# Altium project POWER_DC_5V.PrjPcb
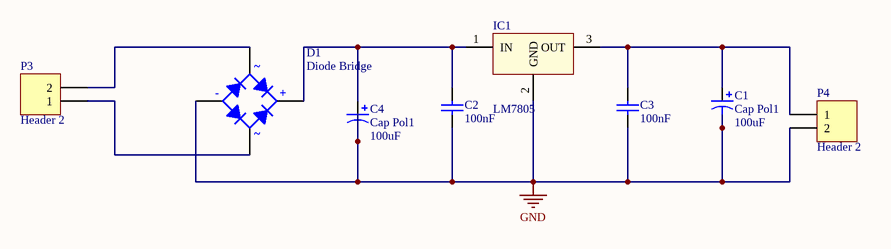
[diagram p0: Sheet1.SchDoc]
1 sheet, 8 parts. Net scope: global (net labels, ports and power ports of the same name join across sheets).
Board file: PowerDC_5V.PcbDoc

## Sheet Sheet1.SchDoc
size A; SheetNumber: 1; SheetTotal: 1

### Parts
C1  Cap Pol1  value 100uF  [CAP_POL_3MM]
C2  100nF  [Cap Non Pol 3mm]
C3  100nF  [Cap Non Pol 3mm]
C4  Cap Pol1  value 100uF  [CAP_POL_3MM]
D1  Diode Bridge  [DIODE BRIDGE (1A)]
IC1  LM7805  [QTO-220]
P3  Header 2  [Header 2]
P4  Header 2  [Header 2]

### Nets
GND: C1.2 C2.1 C3.1 C4.2 D1.4(A) IC1.2(GND) P4.2
NetC1_1: C1.1 C3.2 IC1.3(OUT) P4.1
NetC2_2: C2.2 C4.1 D1.1(K) IC1.1(IN)
NetD1_2: D1.2(C) P3.2
NetD1_3: D1.3(C) P3.1

### Notes on the sheet
- (in symbol Diode Bridge) ~; -; +

### Library data of the parts
C1 C4 = Cap Pol1: Polarized Capacitor (Radial); Published: 8-Jun-2000; LatestRevisionDate: 17-Jul-2002; LatestRevisionNote: Re-released for DXP Platform.; PackageReference: RB7.6-15; Publisher: Altium Limited; PackageDescription: Polarized Capacitor (Radial); 2 Leads
C2 C3 = Cap Non Pol: Cap Nol Pol; Volt: 16V; Value: 100nF
D1 = Diode Bridge: Full Wave Diode Bridge; Published: 8-Jun-2000; LatestRevisionDate: 17-Jul-2002; LatestRevisionNote: Re-released for DXP Platform.; PackageReference: D-38; Publisher: Altium Limited
IC1 = LM78xx: On ap +, from + 5 to + 24VDC; Value: LM7805
P3 P4 = Header 2: Header, 2-Pin; LatestRevisionDate: 17-Jul-2002; LatestRevisionNote: Re-released for DXP Platform.; Publisher: Altium Limited